# Altium schematic sheet 24V_Regulator.SchDoc: +24V Regulator
size A4; Organization: Altium Limited; Address1: L3, 12a Rodborough Rd; Address2: Frenchs Forest; Address3: NSW; Address4: Australia 2086
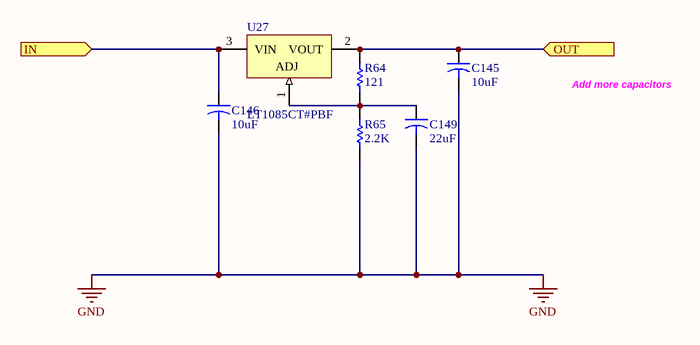
[diagram p0: 24V_Regulator.SchDoc]

## Parts
C145  10uF  [Tantalum_2917]
C146  10uF  [Tantalum_2917]
C149  22uF  [Tantalum_2917]
R64  121  [2512_SMD]
R65  2.2K  [2512_SMD]
U27  LT1085CT#PBF  [LT-T-3]

## Ports
IN (in), OUT (in)

## Nets
GND: C145.2 C146.2 C149.2 R65.1
IN: C146.1 U27.3(VIN) ; port IN
OUT: C145.1 R64.2 U27.2(VOUT) ; port OUT
NetC149_1: C149.1 R64.1 R65.2 U27.1(ADJ)

## Notes on the sheet
- Add more capacitors
- Title
- Date:
- RE:
- Arturo di Girolamo
- Size:
- A3
- A

## Library data of the parts
C145 C146 = UVR1V102MHD1TO: Capacitor, 100uF NICHICON; ASYPN: T495D106K035ATE260; MFGPN: UVR1V102MHD1TO
C149 = UVR1V102MHD1TO: Capacitor, 100uF NICHICON; ASYPN: T496D226K025ATE800; MFGPN: UVR1V102MHD1TO
R64 = RR1220P-104-D: 100K 1% 1/10W; Value: 1K; ASYPN: RMCF2512FT121R; MFGPN: RR1220P-104-D
R65 = RR1220P-104-D: 100K 1% 1/10W; Value: 1K; ASYPN: 35212K2FT; MFGPN: RR1220P-104-D
U27 = CMP-0476-01891-1: 3 A Low Dropout Positive Regulator, 2.55 to 30 V Vin, Adjustable Vout, 3-pin FM (T-3), 0 to 150 degC, Pb-Free; Manufacturer: Linear Technology; Discrete Pass Element: no; Iout(mA): 3000; PSRR(dB): 75; Vout Max(V): 28.5; Vout Min(V): 1.25; Number of Outputs: 1; Vin Max(V): 30; Vin Min(V): 2.55; Dropout Voltage(V): 1.3; Isupply(mA): 5; Output Voltage: Adj; ComponentLink3Description: Package Specification; PackageDescription: 3-Pin Plastic TO-220, Body 10.2235 x 4.3815 mm, Pitch 2.54 mm; ComponentLink2URL: http://cds.linear.com/docs/en/datasheet/108345fg.pdf; DatasheetVersion: Rev. G; PartNumber: LT1085CT#PBF; RoHS: TRUE; ComponentLink1URL: http://www.linear.com/; ComponentLink2Description: Datasheet; Mounting Technology: Through Hole; PackageVersion: Jun-10; ComponentLink1Description: Manufacturer URL; ComponentLink3URL: http://cds.linear.com/docs/en/packaging/TO-220_3_05-08-1420.pdf; PackageReference: T-3